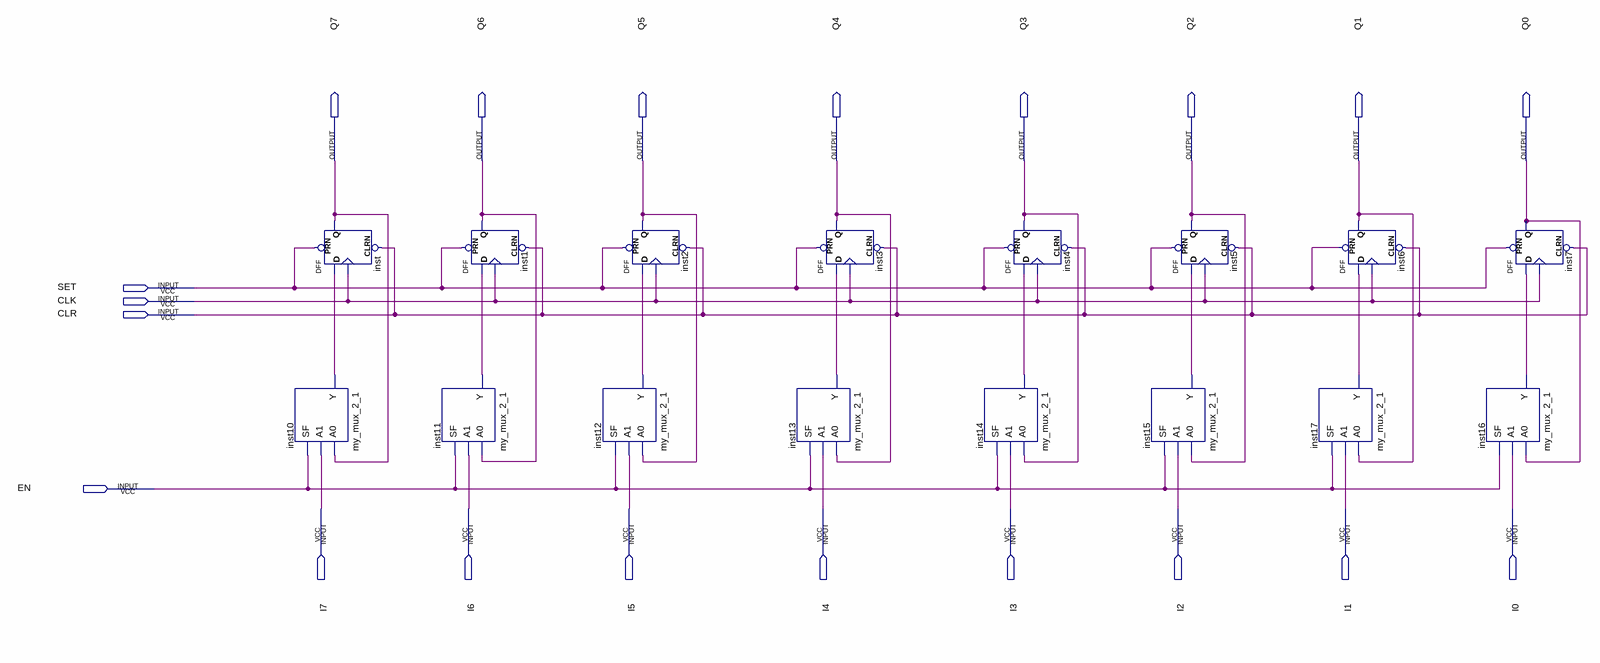
[diagram p0: schematic sheet]
// Quartus schematic MyMux_4_1.bdf as structural Verilog: 16 symbols, 20 pins
module MyMux_4_1 (
  input  SET,
  input  CLK,
  input  CLR,
  input  EN,
  input  I7,
  input  I6,
  input  I5,
  input  I4,
  input  I3,
  input  I2,
  input  I1,
  input  I0,
  output Q7,
  output Q6,
  output Q5,
  output Q4,
  output Q3,
  output Q2,
  output Q1,
  output Q0
);

  wire inst10_y, inst11_y, inst12_y, inst13_y, inst14_y, inst15_y, inst16_y, inst17_y;

  my_mux_2_1 inst10 (.A0(Q7), .A1(I7), .SF(EN), .Y(inst10_y));
  DFF inst (.CLRN(CLR), .CLK(CLK), .D(inst10_y), .PRN(SET), .Q(Q7));
  my_mux_2_1 inst11 (.A0(Q6), .A1(I6), .SF(EN), .Y(inst11_y));
  DFF inst1 (.CLRN(CLR), .CLK(CLK), .D(inst11_y), .PRN(SET), .Q(Q6));
  my_mux_2_1 inst12 (.A0(Q5), .A1(I5), .SF(EN), .Y(inst12_y));
  DFF inst2 (.CLRN(CLR), .CLK(CLK), .D(inst12_y), .PRN(SET), .Q(Q5));
  DFF inst3 (.CLRN(CLR), .CLK(CLK), .D(inst13_y), .PRN(SET), .Q(Q4));
  my_mux_2_1 inst13 (.A0(Q4), .A1(I4), .SF(EN), .Y(inst13_y));
  my_mux_2_1 inst14 (.A0(Q3), .A1(I3), .SF(EN), .Y(inst14_y));
  DFF inst4 (.CLRN(CLR), .CLK(CLK), .D(inst14_y), .PRN(SET), .Q(Q3));
  my_mux_2_1 inst15 (.A0(Q2), .A1(I2), .SF(EN), .Y(inst15_y));
  DFF inst5 (.CLRN(CLR), .CLK(CLK), .D(inst15_y), .PRN(SET), .Q(Q2));
  DFF inst6 (.CLRN(CLR), .CLK(CLK), .D(inst17_y), .PRN(SET), .Q(Q1));
  my_mux_2_1 inst17 (.A0(Q1), .A1(I1), .SF(EN), .Y(inst17_y));
  DFF inst7 (.CLRN(CLR), .CLK(CLK), .D(inst16_y), .PRN(SET), .Q(Q0));
  my_mux_2_1 inst16 (.A0(Q0), .A1(I0), .SF(EN), .Y(inst16_y));
endmodule
